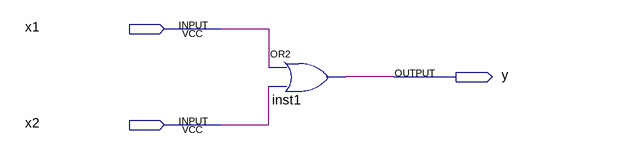
[diagram p0: schematic sheet]
// Quartus schematic lab12.bdf as structural Verilog: 1 symbols, 3 pins
module lab12 (
  input  x1,
  input  x2,
  output y
);

  or inst1 (y, x1, x2);
endmodule
